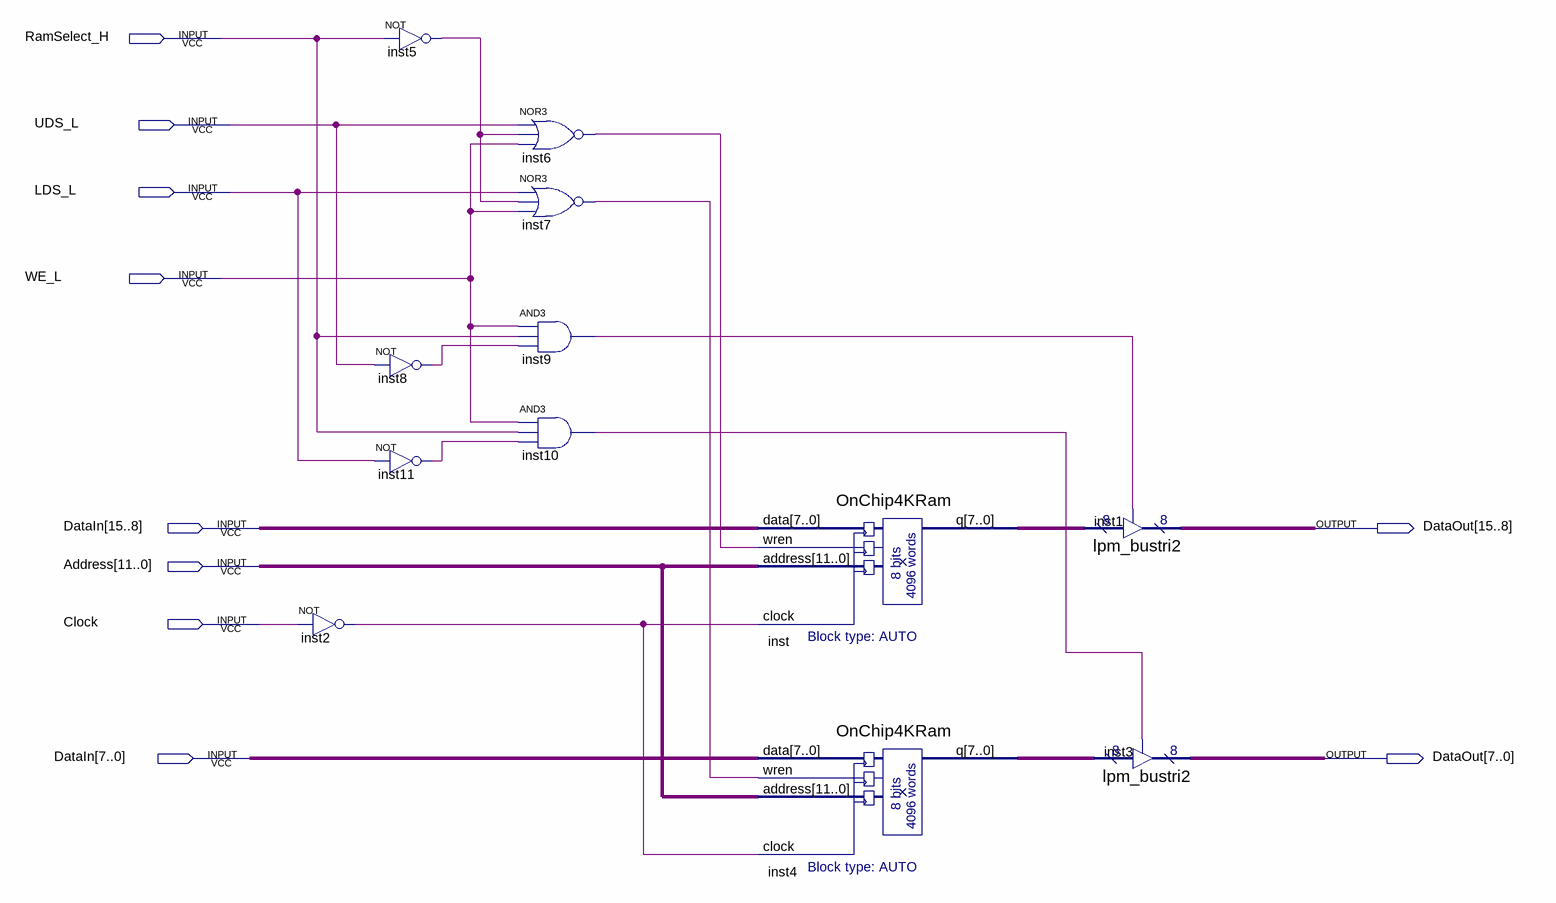
[diagram p0: schematic sheet]
// Quartus schematic OnChip8KbyteRam.bdf as structural Verilog: 12 symbols, 10 pins
module OnChip8KbyteRam (
  input  RamSelect_H,
  input  UDS_L,
  input  LDS_L,
  input  WE_L,
  input  [15:0] DataIn,
  input  [11:0] Address,
  input  Clock,
  output [15:0] DataOut
);

  wire inst2_out, inst5_out, inst6_out, inst7_out, inst8_out, inst9_out, inst10_out, inst11_out;
  wire [7:0] inst4_q, inst_q;

  not inst2 (inst2_out, Clock);
  not inst8 (inst8_out, UDS_L);
  not inst11 (inst11_out, LDS_L);
  not inst5 (inst5_out, RamSelect_H);
  nor inst6 (inst6_out, UDS_L, inst5_out, WE_L);
  nor inst7 (inst7_out, LDS_L, inst5_out, WE_L);
  and inst9 (inst9_out, WE_L, RamSelect_H, inst8_out);
  and inst10 (inst10_out, WE_L, RamSelect_H, inst11_out);
  OnChip4KRam inst (.data(DataIn[15:8]), .wren(inst6_out), .address(Address), .clock(inst2_out), .q(inst_q));
  OnChip4KRam inst4 (.data(DataIn[7:0]), .wren(inst7_out), .address(Address), .clock(inst2_out), .q(inst4_q));
  lpm_bustri2 inst1 (.enabledt(inst9_out), .data(inst_q), .tridata(DataOut[15:8]));
  lpm_bustri2 inst3 (.enabledt(inst10_out), .data(inst4_q), .tridata(DataOut[7:0]));
endmodule
